# Altium project HW_PGK.PrjPcb
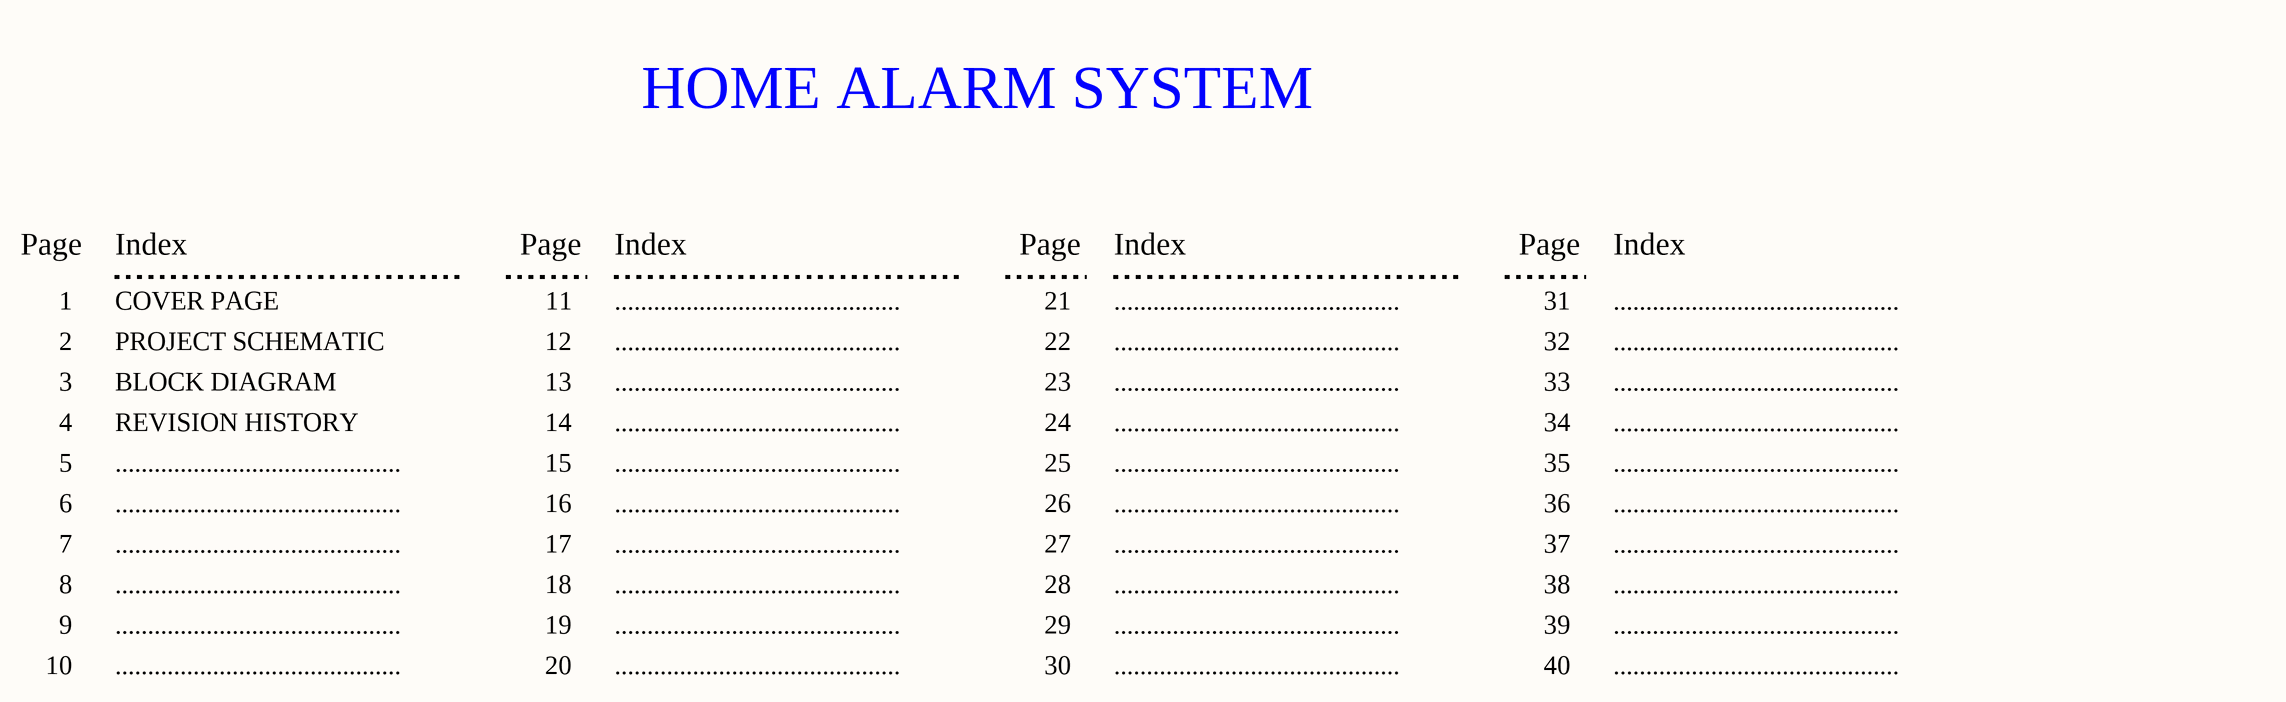
[diagram p0: 01-Cover page.SchDoc]
3 sheets, 28 parts. Net scope: global (net labels, ports and power ports of the same name join across sheets).
Board file: PCB1.PcbDoc
Sheets:
  01-Cover page.SchDoc
  02-Schematic.SchDoc
  03-Block diagram.SchDoc

## Sheet 01-Cover page.SchDoc
size A3; SheetNumber: 1; SheetTotal: 3

### Notes on the sheet
- HOME ALARM SYSTEM
- Page
- Index
- 1
- COVER PAGE
- 11
- ............................................
- 21
- 31
- 2
- 3
- BLOCK DIAGRAM
- PROJECT SCHEMATIC
- 12
- 13
- 22
- 23
- 32
- 33
- 4
- 5
- REVISION HISTORY
- 14
- 15
- 24
- 25
- 34
- 35
- 6
- 16
- 26
- 36
- 7
- 8
- 17
- 18
- 27
- 28
- 37
- 38
- 9
- 10
- 19
- 20
- 29
- 30
- 39
- 40

## Sheet 02-Schematic.SchDoc: My Design
size 431 x 279 mm; Date: 3/5/2025; ApprovedBy: PhamGiaKhanh; CheckedBy: PhamGiaKhanh; Author: PhamGiaKhanh; CompanyName: HCMUT; DrawnBy: PhamGiaKhanh; Engineer: PhamGiaKhanh; Organization: HCMUT; DocumentNumber: 1; Revision: 1.0; SheetNumber: 2; SheetTotal: 3; Project: STM32; ENG_APP_DATE: --/--/--; DSN_APP_DATE: --/--/--; CHK_APP_DATE: --/--/--; Time: 15:20
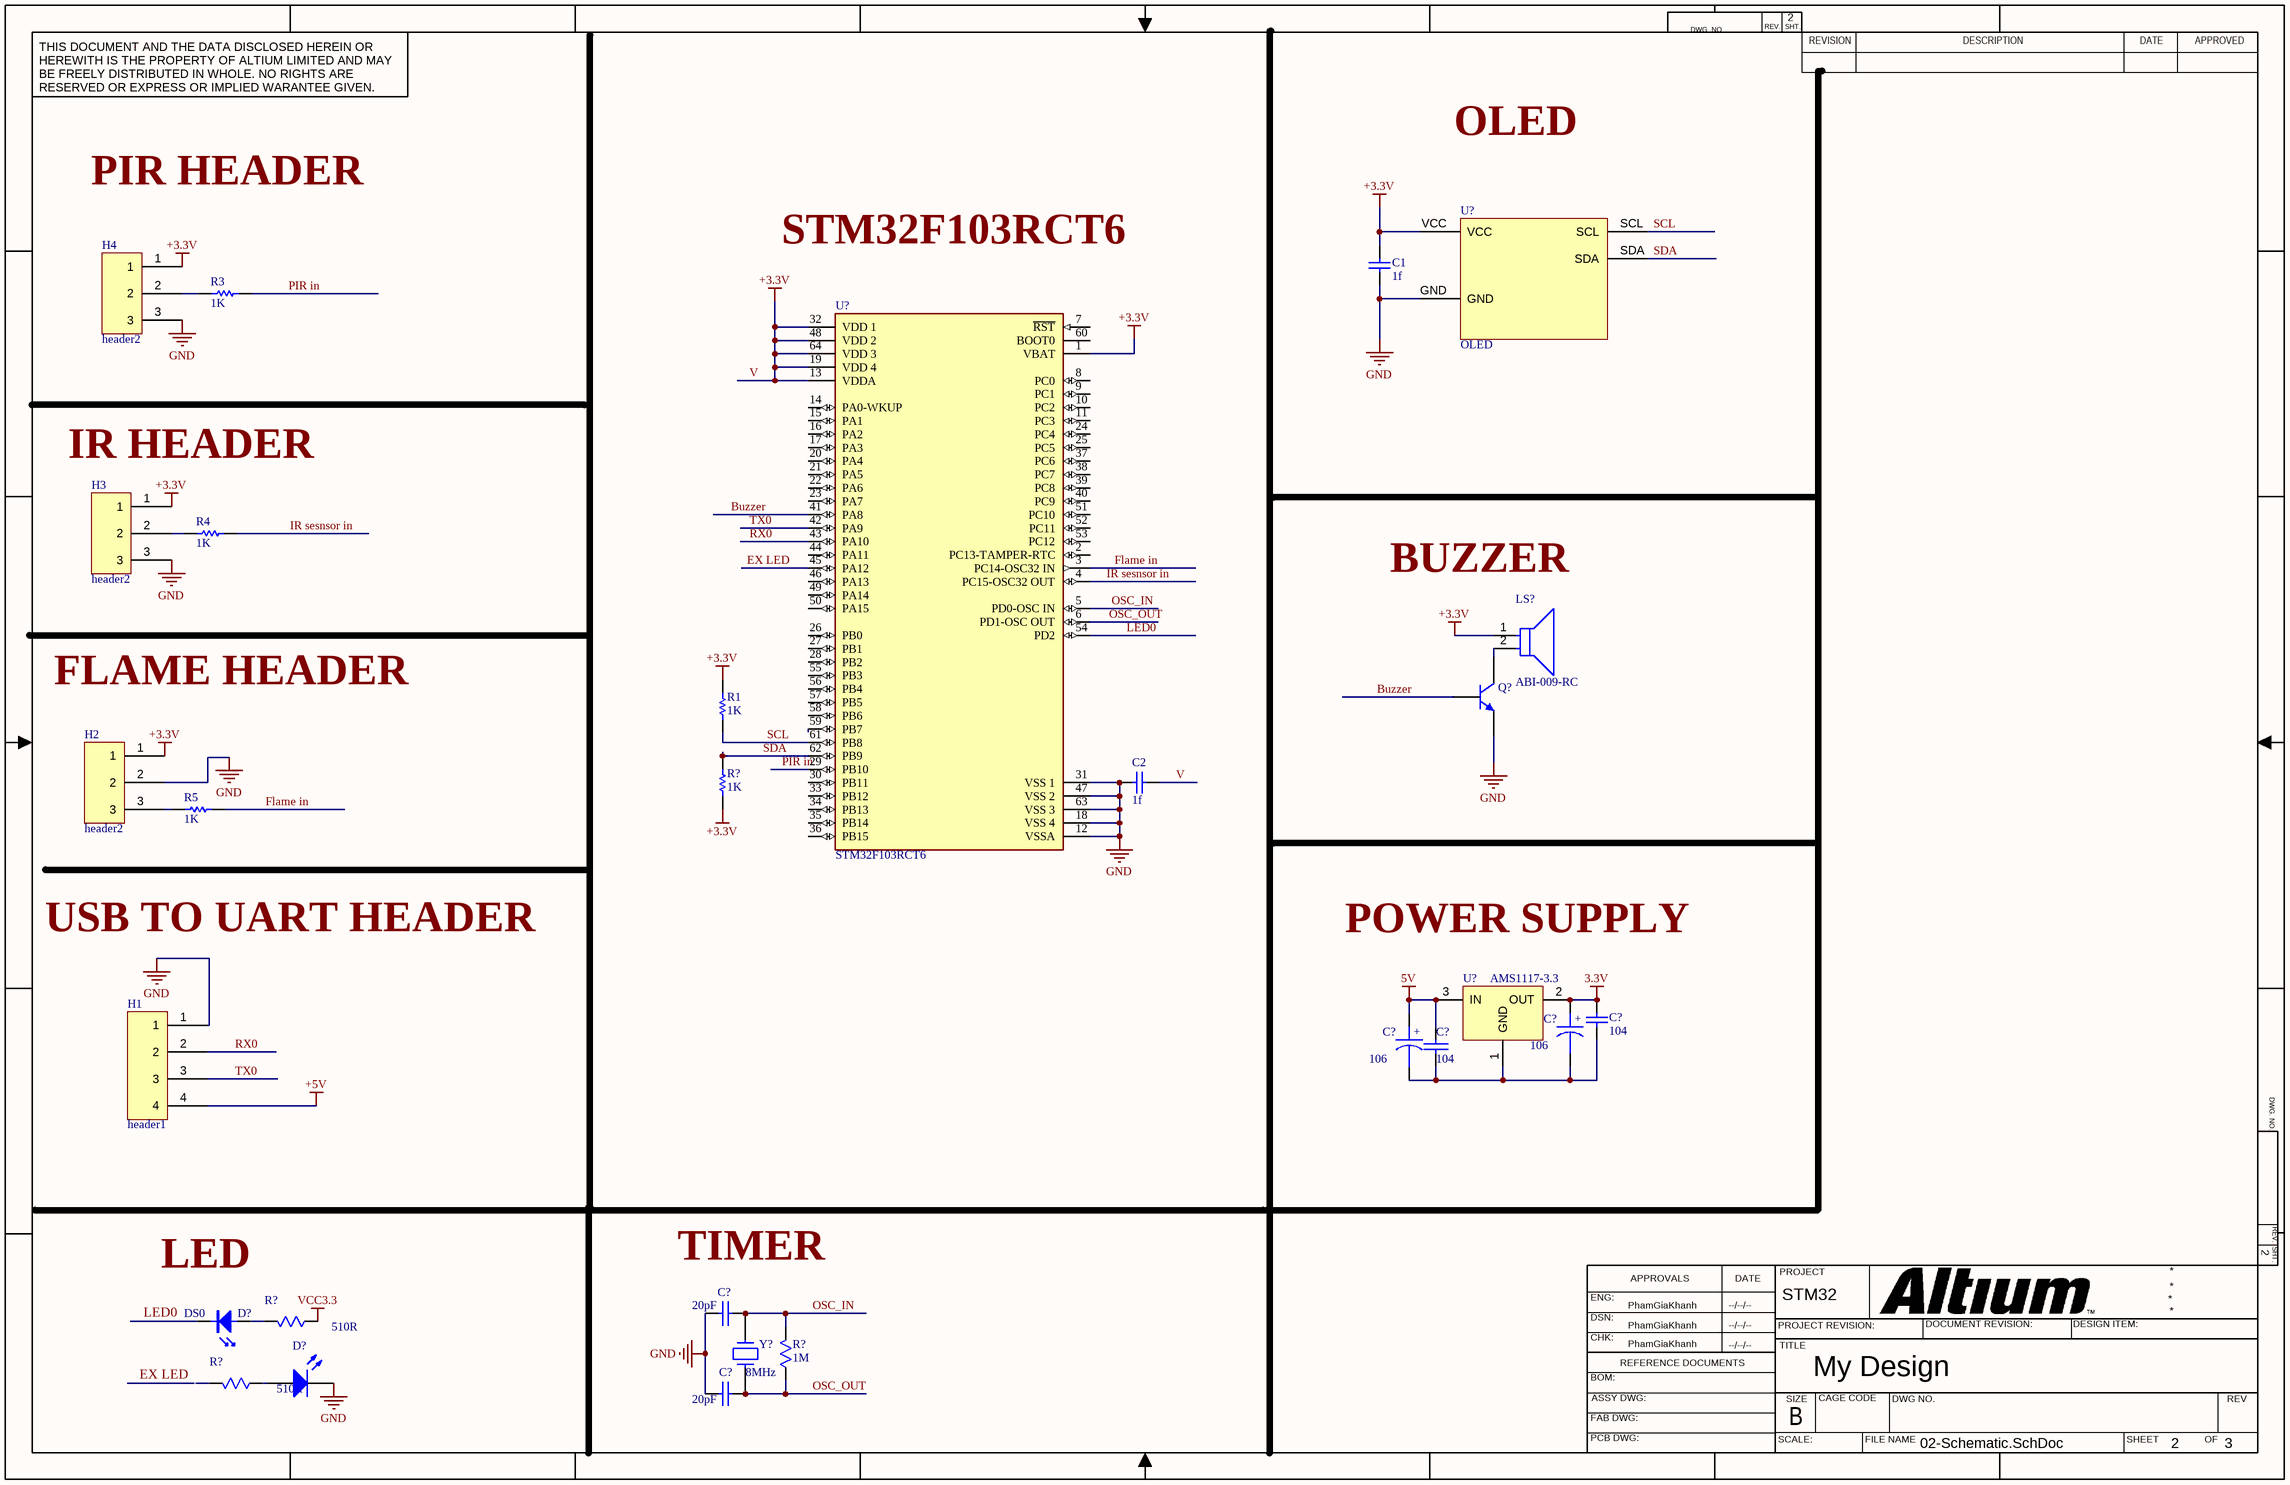
[diagram p1: 02-Schematic.SchDoc]

### Parts
(Parts that share a designator on the sheet are numbered #1, #2 ... from top to bottom, then left to right.)
C1  value 1f  (hidden comment: Capacitor)
C2  value 1f  (hidden comment: Capacitor)
C?#1  106  [RC0805]
C?#2  104  [0603J]
C?#3  106  [RC0805]
C?#4  104  [0603J]
C?#5  20pF  [0603J]
C?#6  20pF  [0603J]
D?#1  DS0  [LED0805]
D?#2  Light-Emitting Diode  (value not drawn)
H1  header1
H2  header2
H3  header2
H4  header2
LS?  ABI-009-RC  [FP-PS1440P02BT-MFG]
Q?  Bipolar NPN 3 Pins Transistor Gummel-Poon Model  (value not drawn)
R1  value 1K  (hidden comment: Resistor)
R3  value 1K  (hidden comment: Resistor)
R4  value 1K  (hidden comment: Resistor)
R5  value 1K  (hidden comment: Resistor)
R?#1  value 1K  (hidden comment: Resistor)
R?#2  510R  [0603J]
R?#3  1M  [0603J]
R?#4  510R  [0603J]
U?#1  STM32F103RCT6  [FP-LQFP64-5W-MFG]
U?#2  OLED
U?#3  AMS1117-3.3  [SOT223]
Y?  8MHz  [smt-xtal]

### Nets
3.3V: C?#1.1 C?#2.1 U?#3.2(OUT)
5V: C?#3.1 C?#4.1 U?#3.3(IN)
+5V: H1.4
GND: C1.1 C2.1 C?#5.1 C?#6.1 D?#2.2(K) H1.1 H2.2 H3.3 H4.3 Q?.3(E) U?#1.12(VSSA) U?#1.18(VSS_4) U?#1.31(VSS_1) U?#1.47(VSS_2) U?#1.63(VSS_3) U?#2.GND
V: C1.2 C2.2 H2.1 H3.1 H4.1 LS?.1 R1.2 R?#1.1 U?#1.1(VBAT) U?#1.13(VDDA) U?#1.19(VDD_4) U?#1.32(VDD_1) U?#1.48(VDD_2) U?#1.64(VDD_3) U?#2.VCC  [also labelled +3.3V]
VCC3.3: R?#2.1
Buzzer: Q?.2(B) U?#1.41(PA8)
EX LED: U?#1.45(PA12)
Flame in: R5.1 U?#1.3(PC14-OSC32_IN)
IR sesnsor in: R4.1 U?#1.4(PC15-OSC32_OUT)
LED0: D?#1.2 U?#1.54(PD2)
OSC_IN: C?#5.2 R?#3.2 U?#1.5(PD0-OSC_IN) Y?.1
OSC_OUT: C?#6.2 R?#3.1 U?#1.6(PD1-OSC_OUT) Y?.2
PIR in: R3.2 U?#1.29(PB10)
RX0: H1.2 U?#1.43(PA10)
SCL: R1.1 U?#1.61(PB8) U?#2.SCL
SDA: R?#1.2 U?#1.62(PB9) U?#2.SDA
TX0: H1.3 U?#1.42(PA9)
NetC?#1_2: C?#1.2 C?#2.2 C?#3.2 C?#4.2 U?#3.1(GND)
NetD?#1_1: D?#1.1 R?#2.2
NetD?#2_1: D?#2.1(A) R?#4.1
NetH2_3: H2.3 R5.2
NetH3_2: H3.2 R4.2
NetH4_2: H4.2 R3.1
NetLS?_2: LS?.2 Q?.1(C)

Not connected (* = marked no-connect by the designer): R?#4 2; U?#1 2(PC13-TAMPER-RTC) 7(~{RST}) 8(PC0) 9(PC1) 10(PC2) 11(PC3) 14(PA0-WKUP) 15(PA1) 16(PA2) 17(PA3) 20(PA4) 21(PA5) 22(PA6) 23(PA7) 24(PC4) 25(PC5) 26(PB0) 27(PB1) 28(PB2) 30(PB11) 33(PB12) 34(PB13) 35(PB14) 36(PB15) 37(PC6) 38(PC7) 39(PC8) 40(PC9) 44(PA11) 46(PA13) 49(PA14) 50(PA15) 51(PC10) 52(PC11) 53(PC12) 55(PB3) 56(PB4) 57(PB5) 58(PB6) 59(PB7) 60(BOOT0)

### Notes on the sheet
- OLED
- PIR HEADER
- STM32F103RCT6
- (near H3) IR HEADER
- (near LS?) BUZZER
- FLAME HEADER
- USB TO UART HEADER
- POWER SUPPLY
- LED
- (near C?#5) TIMER
- DWG. NO.
- REV.
- SHT.
- THIS DOCUMENT AND THE DATA DISCLOSED HEREIN OR HEREWITH IS THE PROPERTY OF ALTIUM LIMITED AND MAY BE FREELY DISTRIBUTED IN WHOLE. NO RIGHTS ARE RESERVED OR EXPRESS OR IMPLIED WARANTEE GIVEN.
- REVISION
- DESCRIPTION
- DATE
- APPROVED
- ENG:
- APPROVALS
- PROJECT
- DSN:
- CHK:
- REFERENCE DOCUMENTS
- PROJECT REVISION:
- TITLE
- DOCUMENT REVISION:
- DESIGN ITEM:
- BOM:
- FAB DWG:
- PCB DWG:
- ASSY DWG:
- SCALE:
- SIZE
- B
- CAGE CODE
- FILE NAME
- DWG NO.
- SHEET
- OF
- REV
- (in symbol CAPACITOR POL) +

### Library data of the parts
C1 C2 = Capacitor: SimulationGenericComponent: True
C?#1 C?#3 = CAPACITOR POL: Capacitor
C?#2 = Cap: Capacitor; Published: 8-Jun-2000; LatestRevisionDate: 17-Jul-2002; LatestRevisionNote: Re-released for DXP Platform.; PackageReference: RAD-0.3; Publisher: Altium Limited
C?#4 = CAP: Capacitor
C?#5 C?#6 = CAP: CAP CHIP 20P 50V(+-5% C0G 0603); Value: 20pF
D?#1 = LED
D?#2 = LED: AF: 1; BV: 0; BV_MAX: 1e99; EG: 1.11; FC: 0.5; IBV: 0.001; IS: 1e-14; MJSW: 0.33; NTUN: 30; TNOM: 27; XTI: 3; SimulationGenericComponent: True; CJO: 0; CJP: 0; CTA: 0; CTP: 0; FCS: 0.5; FV_MAX: 1e99; IKF: 0; IKR: 0; ISR: 1e-14; JSW: 0; JTUN: 0; JTUNSW: 0; KEG: 1; KF: 0; LEVEL: 1; N: 1; NBV: 1; NR: 1; NS: 1; PHP: 1; RS: 0; TCV: 0; TLEV: 0; TLEVC: 0; TM1: 0; TM2: 0; TPB: 0; TPHP: 0; TRS: 0; TRS2: 0; TT: 0; TTT1: 0; TTT2: 0; VJ: 1; XTITUN: 3
H2 = header2: hshop flame sensor-HS0242
H3 = header2: hshop IR Infared Obstacle Avoidance-HS0267
H4 = header2: hshop PIR SR505-HS0251
LS? = CMP-08413-000003-1: hshop buzzer-HS0640; Self Resonant Frequency: 4kHz; Washable: No; Voltage Rating (DC): 3V; Number of Terminals/Pins: 2; Packaging: Tape and Reel; Lead Free: Lead Free; Min Operating Temperature: -10°C; Package Quantity: 350; Termination: PC Pins; Mount: Through Hole; Max Operating Temperature: 70°C; Operating Supply Voltage: 3V; Diameter: 14mm; RoHS Compliant: Yes; Frequency: 4kHz; Height: 8mm
Q? = BJT NPN_GP: SimulationGenericComponent: True; BF: 100; AF: 0; BR: 1; EG: 1.11; FC: 0.5; IS: 1e-16; MJC: 0.33; NC: 2; NE: 1.5; TNOM: 27; VBC_MAX: 1e99; VJC: 0.75; XTI: 3; CJC: 0; CJE: 0; CJS: 0; CTC: 0; CTE: 0; CTS: 0; IKF: 0; IKR: 0; IRB: 0; ISC: 0; ISE: 0; ISS: 0; ITF: 0; KF: 0; MJE: 0.33; MJS: 0; NF: 1; NKF: 0.5; NR: 1; NS: 1; PTF: 0; RB: 0; RBM: 0; RC: 0; RE: 0; SUBS: 1; TBF1: 0; TBF2: 0; TBR1: 0; TBR2: 0; TF: 0; TIKF1: 0; TIKF2: 0; TIKR1: 0; TIKR2: 0; TIRB1: 0; TIRB2: 0; TIS1: 0; TIS2: 0; TISC1: 0; TISC2: 0; TISE1: 0; TISE2: 0; TITF1: 0; TITF2: 0; TLEV: 0; TLEVC: 0; TMJC1: 0; TMJC2: 0; TMJE1: 0; TMJE2: 0; TMJS1: 0; TMJS2: 0; TNC1: 0; TNC2: 0; TNE1: 0; TNE2: 0; TNF1: 0; TNF2: 0; TNR1: 0; TNR2: 0; TNS1: 0; TNS2: 0; TR: 0; TRB1: 0; TRB2: 0; TRC1: 0; TRC2: 0; TRE1: 0; TRE2: 0; TRM1: 0; TRM2: 0; TTF1: 0; TTF2: 0; TTR1: 0; TTR2: 0; TVAF1: 0; TVAF2: 0; TVAR1: 0; TVAR2: 0; TVJC: 0; TVJE: 0; TVJS: 0; VAF: 0; VAR: 0; VBE_MAX: 1e99; VCE_MAX: 1e99; VJE: 0.75; VJS: 0.75; VTF: 0; XCJC: 1; XTB: 0; XTF: 0
R1 R3-R5 R?#1 = Resistor: TC1: 0; SimulationGenericComponent: True; TC2: 0
R?#2-R?#4 = RES
U?#1 = CMP-0237-00009-5: IC MCU 32BIT 256KB FLASH 64LQFP; Interface: I2C; Number of I/Os: 51; Number of SPI Channels: 3; Min Supply Voltage: 2V; Peripherals: POR; Max Frequency: 72MHz; Max Power Dissipation: 444mW; Number of Timers/Counters: 8; Data Bus Width: 32b; Number of ADC Channels: 16; RAM Size: 48KB; Max Supply Voltage: 3.6V; Number of I2C Channels: 2; Watchdog Timer: Yes; Oscillator Type: Internal; Core Architecture: ARM; Number of Bits: 32; Package Quantity: 960; REACH SVHC: No SVHC; Width: 10mm; Weight: 0.012088oz; Max Operating Temperature: 85°C; Radiation Hardening: No; Length: 10mm; Height: 1.4mm; Number of Programmable I/O: 51; Frequency: 72MHz; Series: STM32F103RC; Min Operating Temperature: -40°C; Number of PWM Channels: 16; Memory Size: 256KB; Lead Free: Lead Free; Packaging: Tray; Termination: SMD/SMT; RoHS Compliant: Yes; Number of Pins: 64; Case/Package: LQFP; Density: 256KB; Memory Type: FLASH
U?#2 = OLED: hshop OLED 0'96 inch - HS0617
U?#3 = LT1085CM-3.3: hshop DC-DC Power Supply 3.3VDC ASM1117-HS0733
Y? = CRYSTAL: Crystal 8MHz PLUG; Value: 8MHz

## Sheet 03-Block diagram.SchDoc
size A3; SheetNumber: 3; SheetTotal: 3
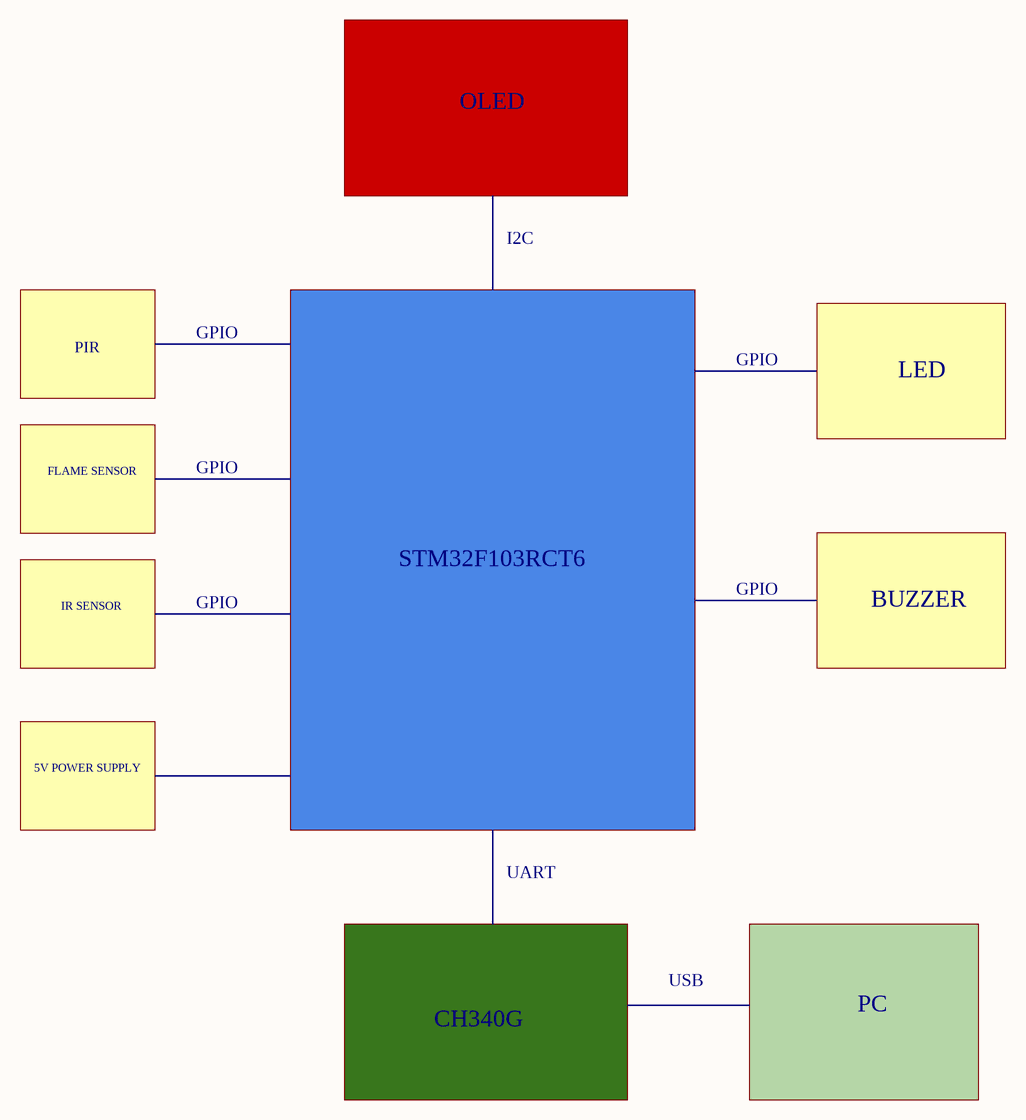
[diagram p2: 03-Block diagram.SchDoc]

### Notes on the sheet
- OLED
- I2C
- PIR
- GPIO
- LED
- FLAME SENSOR
- STM32F103RCT6
- IR SENSOR
- BUZZER
- 5V POWER SUPPLY
- UART
- USB
- CH340G
- PC